# Altium schematic sheet CAN_ADS1015.SchDoc: CAN and ADC expansor
size A3; Organization: ORGANIZATION; Address1: ADDRESS 1; Address2: ADDRESS 2; Address3: ADDRESS 3; Address4: ADDRESS 4; Revision: 0.0; SheetNumber: 8; SheetTotal: 19; ENG_APP_DATE: --/--/--; DSN_APP_DATE: --/--/--; CHK_APP_DATE: --/--/--
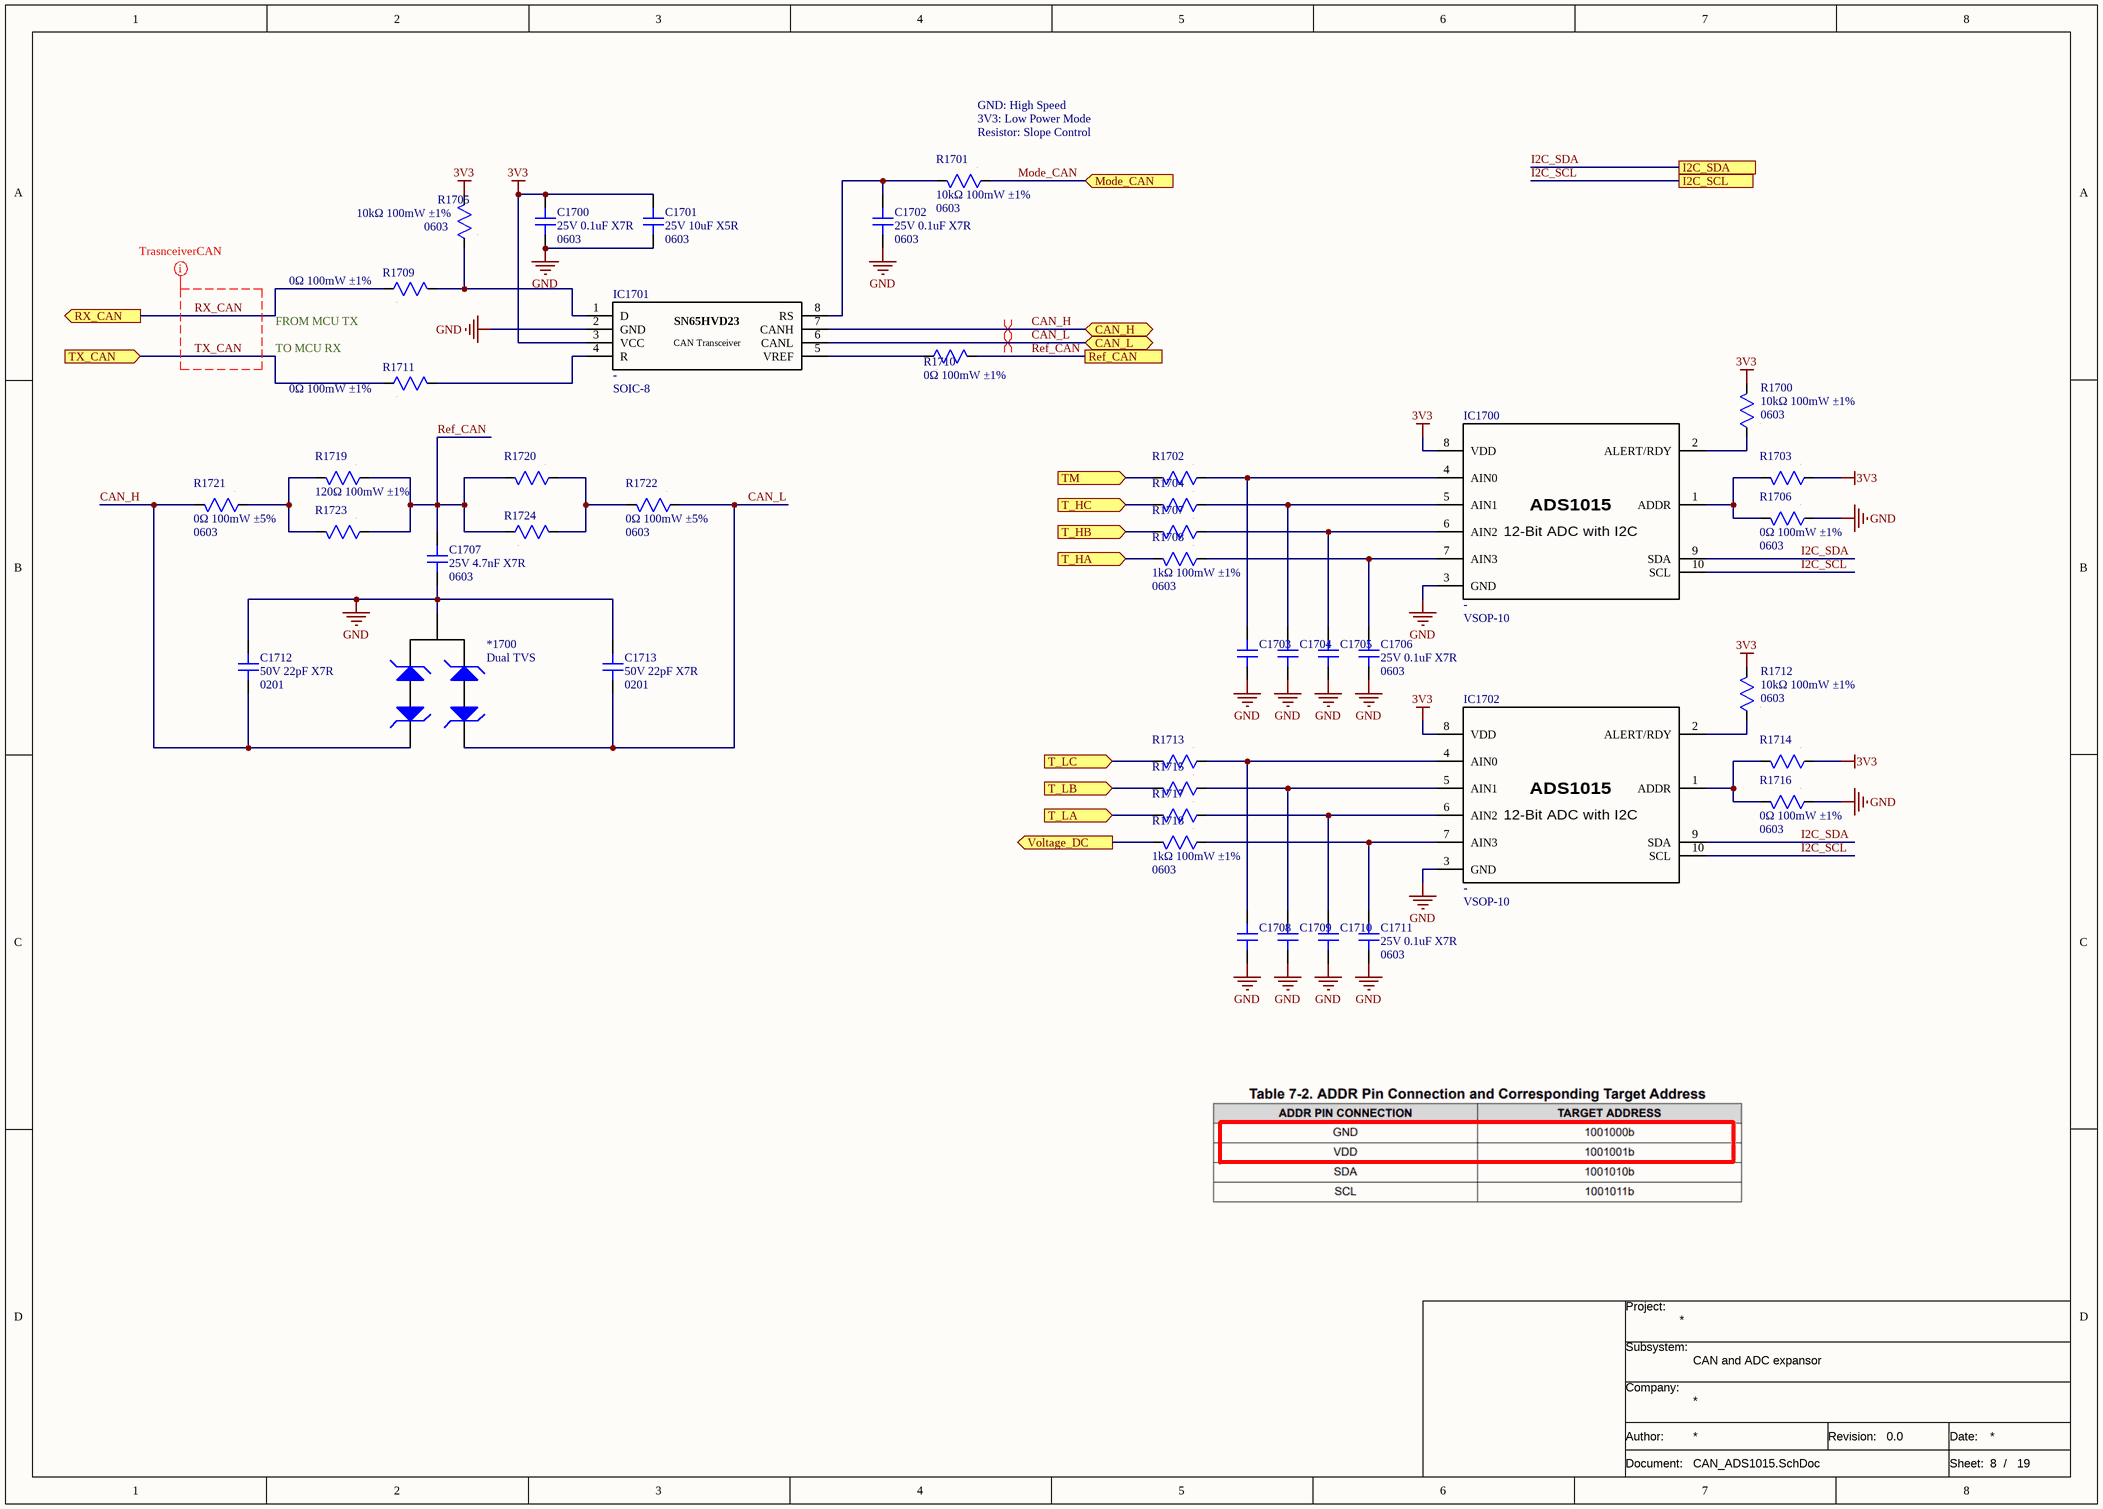
[diagram p0: CAN_ADS1015.SchDoc]

## Parts
*1700  Dual TVS  [SOT-23]
C1700  value 25V 0.1uF X7R  Package: 0603  [CAP SMD 0603]  (hidden comment: CAP non polarized)
C1701  value 25V 10uF X5R  Package: 0603  [CAP SMD 0603]  (hidden comment: CAP non polarized)
C1702  value 25V 0.1uF X7R  Package: 0603  [CAP SMD 0603]  (hidden comment: CAP non polarized)
C1703  CAP non polarized  [CAP SMD 0603]  (value not drawn)
C1704  CAP non polarized  [CAP SMD 0603]  (value not drawn)
C1705  CAP non polarized  [CAP SMD 0603]  (value not drawn)
C1706  value 25V 0.1uF X7R  Package: 0603  [CAP SMD 0603]  (hidden comment: CAP non polarized)
C1707  value 25V 4.7nF X7R  Package: 0603  [CAP SMD 0603]  (hidden comment: CAP non polarized)
C1708  CAP non polarized  [CAP SMD 0603]  (value not drawn)
C1709  CAP non polarized  [CAP SMD 0603]  (value not drawn)
C1710  CAP non polarized  [CAP SMD 0603]  (value not drawn)
C1711  value 25V 0.1uF X7R  Package: 0603  [CAP SMD 0603]  (hidden comment: CAP non polarized)
C1712  value 50V 22pF X7R  Package: 0201  [CAP SMD 0201]  (hidden comment: CAP non polarized)
C1713  value 50V 22pF X7R  Package: 0201  [CAP SMD 0201]  (hidden comment: CAP non polarized)
IC1700  ADS1015  [VSOP-10]  (value not drawn)
IC1701  SN65HVD23  [SOIC-8]  (value not drawn)
IC1702  ADS1015  [VSOP-10]  (value not drawn)
R1700  value 10kΩ 100mW ±1%  Package: 0603  [RES SMD 0603]  (hidden comment: RES)
R1701  value 10kΩ 100mW ±1%  Package: 0603  [RES SMD 0603]  (hidden comment: RES)
R1702  RES  [RES SMD 0603]  (value not drawn)
R1703  RES  [RES SMD 0603]  (value not drawn)
R1704  RES  [RES SMD 0603]  (value not drawn)
R1705  value 10kΩ 100mW ±1%  Package: 0603  [RES SMD 0603]  (hidden comment: RES)
R1706  value 0Ω 100mW ±1%  Package: 0603  [RES SMD 0603]  (hidden comment: RES)
R1707  RES  [RES SMD 0603]  (value not drawn)
R1708  value 1kΩ 100mW ±1%  Package: 0603  [RES SMD 0603]  (hidden comment: RES)
R1709  value 0Ω 100mW ±1%  [RES SMD 0603]  (hidden comment: RES)
R1710  value 0Ω 100mW ±1%  [RES SMD 0603]  (hidden comment: RES)
R1711  value 0Ω 100mW ±1%  [RES SMD 0603]  (hidden comment: RES)
R1712  value 10kΩ 100mW ±1%  Package: 0603  [RES SMD 0603]  (hidden comment: RES)
R1713  RES  [RES SMD 0603]  (value not drawn)
R1714  RES  [RES SMD 0603]  (value not drawn)
R1715  RES  [RES SMD 0603]  (value not drawn)
R1716  value 0Ω 100mW ±1%  Package: 0603  [RES SMD 0603]  (hidden comment: RES)
R1717  RES  [RES SMD 0603]  (value not drawn)
R1718  value 1kΩ 100mW ±1%  Package: 0603  [RES SMD 0603]  (hidden comment: RES)
R1719  value 120Ω 100mW ±1%  [RES SMD 0603]  (hidden comment: RES)
R1720  RES  [RES SMD 0603]  (value not drawn)
R1721  value 0Ω 100mW ±5%  Package: 0603  [RES SMD 0603]  (hidden comment: RES)
R1722  value 0Ω 100mW ±5%  Package: 0603  [RES SMD 0603]  (hidden comment: RES)
R1723  RES  [RES SMD 0603]  (value not drawn)
R1724  RES  [RES SMD 0603]  (value not drawn)

## Ports
CAN_H (bidir), CAN_L (bidir), I2C_SCL, I2C_SDA, Mode_CAN (in), Ref_CAN, RX_CAN (out), T_HA (in), T_HB (in), T_HC (in), T_LA (in), T_LB (in), T_LC (in), TM (in), TX_CAN (in), Voltage_DC (out)

## Nets
3V3: C1700.1 C1701.1 IC1700.8(VDD) IC1701.3(VCC) IC1702.8(VDD) R1700.2 R1703.1 R1705.2 R1712.2 R1714.1
GND: *1700.3 C1700.2 C1701.2 C1702.2 C1703.2 C1704.2 C1705.2 C1706.2 C1707.2 C1708.2 C1709.2 C1710.2 C1711.2 C1712.1 C1713.1 IC1700.3(GND) IC1701.2(GND) IC1702.3(GND) R1706.1 R1716.1
CAN_H: *1700.1 C1712.2 IC1701.7(CANH) R1721.2 ; port CAN_H
CAN_L: *1700.2 C1713.2 IC1701.6(CANL) R1722.1 ; port CAN_L
I2C_SCL: IC1700.10(SCL) IC1702.10(SCL) ; port I2C_SCL
I2C_SDA: IC1700.9(SDA) IC1702.9(SDA) ; port I2C_SDA
Mode_CAN: R1701.1 ; port Mode_CAN
Ref_CAN: C1707.1 R1710.2 R1719.1 R1720.2 R1723.1 R1724.1 ; port Ref_CAN
RX_CAN: R1709.1 ; port RX_CAN
T_HA: R1708.2 ; port T_HA
T_HB: R1707.2 ; port T_HB
T_HC: R1704.2 ; port T_HC
T_LA: R1717.2 ; port T_LA
T_LB: R1715.2 ; port T_LB
T_LC: R1713.2 ; port T_LC
TM: R1702.2 ; port TM
TX_CAN: R1711.1 ; port TX_CAN
Voltage_DC: R1718.2 ; port Voltage_DC
NetC1702_1: C1702.1 IC1701.8(RS) R1701.2
NetC1703_1: C1703.1 IC1700.4(AIN0) R1702.1
NetC1704_1: C1704.1 IC1700.5(AIN1) R1704.1
NetC1705_1: C1705.1 IC1700.6(AIN2) R1707.1
NetC1706_1: C1706.1 IC1700.7(AIN3) R1708.1
NetC1708_1: C1708.1 IC1702.4(AIN0) R1713.1
NetC1709_1: C1709.1 IC1702.5(AIN1) R1715.1
NetC1710_1: C1710.1 IC1702.6(AIN2) R1717.1
NetC1711_1: C1711.1 IC1702.7(AIN3) R1718.1
NetIC1700_1: IC1700.1(ADDR) R1703.2 R1706.2
NetIC1700_2: IC1700.2(ALERT/RDY) R1700.1
NetIC1701_1: IC1701.1(D) R1705.1 R1709.2
NetIC1701_4: IC1701.4(R) R1711.2
NetIC1701_5: IC1701.5(VREF) R1710.1
NetIC1702_1: IC1702.1(ADDR) R1714.2 R1716.2
NetIC1702_2: IC1702.2(ALERT/RDY) R1712.1
NetR1719_2: R1719.2 R1721.1 R1723.2
NetR1720_1: R1720.1 R1722.2 R1724.2

## Layout directives
net class TrasnceiverCAN: RX_CAN, TX_CAN
differential pair: CAN_H, CAN_L

## Notes on the sheet
- GND: High Speed
- 3V3: Low Power Mode
- (near R1701) Resistor: Slope Control
- FROM MCU TX
- TO MCU RX
- Project:
- Subsystem:
- Company:
- Document:
- Author:
- Revision:
- Date:
- Sheet:
- /
- (in symbol 050-0007) CAN Transceiver
- (in symbol 050-0008) 12-Bit ADC with I2C

## Library data of the parts
*1700 = 032-0023: Diodos de Protección contra ESD / Diodos TVS Automotive dual 3- p F +/-24-V +/-30-k; MPN: ESD2CAN24DBZRQ1; Manufacturer: Texas Instruments; ComponentLink1Description: Datasheet; ComponentLink1URL: https://www.ti.com/lit/ds/symlink/esd2canxl24-q1.pdf?ts=1782719399037&ref_url=https%253A%252F%252Fwww.mouser.it%252F; ComponentLink2Description: Distributor Link; ComponentLink2URL: https://www.mouser.es/ProductDetail/Texas-Instruments/ESD2CAN24DBZRQ1?qs=Y0Uzf4wQF3knJz9mU6BNuw%3D%3D; ID: 032-0023; Value: -; Package: SOT-23-3; Distributor PN: 595-ESD2CAN24DBZRQ1; Distributor: Mouser
C1700 C1702 C1706 C1711 = 001-0115: Condensadores de cerámica multicapa (MLCC- SMD/SMT) WCAP-CSGP 0.1uF 0603 10% 25V MLCC; MPN: 885012206071; Manufacturer: Wurth Elektronik; ComponentLink1Description: Datasheet; ComponentLink1URL: https://www.we-online.com/components/products/datasheet/885012206071.pdf; ComponentLink2Description: Distributor Link; ComponentLink2URL: https://www.mouser.es/ProductDetail/Wurth-Elektronik/885012206071?qs=0KOYDY2FL2%2FEBQkuHgvarg%3D%3D; ID: 001-0115; Distributor PN: 710-885012206071; Distributor: Mouser
C1701 = 001-0114: Condensadores de cerámica multicapa (MLCC- SMD/SMT) 0603 25VDC 10uF 10% X5R; MPN: ZRB18AR61E106KE01L; Manufacturer: muRata; ComponentLink1Description: Datasheet; ComponentLink1URL: https://www.mouser.es/ProductDetail/Murata-Electronics/ZRB18AR61E106KE01L?qs=sGAEpiMZZMsh%252B1woXyUXj%2Fze%252BJJ8bUKCZuLWV6qOmdQ%3D; ComponentLink2Description: Distributor Link; ComponentLink2URL: https://www.mouser.es/datasheet/3/76/2/ZRB18AR61E106KE01_02A.pdf; ID: 001-0114; Distributor PN: 81-ZRB18AR61E106KE1L; Distributor: Mouser
C1703-C1705 C1708-C1710 = 001-0115: Condensadores de cerámica multicapa (MLCC- SMD/SMT) WCAP-CSGP 0.1uF 0603 10% 25V MLCC; MPN: 885012206071; Manufacturer: Wurth Elektronik; Value: 25V 0.1uF X7R; ComponentLink1Description: Datasheet; ComponentLink1URL: https://www.we-online.com/components/products/datasheet/885012206071.pdf; ComponentLink2Description: Distributor Link; ComponentLink2URL: https://www.mouser.es/ProductDetail/Wurth-Elektronik/885012206071?qs=0KOYDY2FL2%2FEBQkuHgvarg%3D%3D; Package: 0603; ID: 001-0115; Distributor PN: 710-885012206071; Distributor: Mouser
C1707 = 001-0125: Condensadores de cerámica multicapa (MLCC- SMD/SMT) WCAP-CSGP 4700pF 0603 10% 25V MLCC; MPN: 885012206063; Manufacturer: Wurth Elektronik; ComponentLink1Description: Datasheet; ComponentLink1URL: https://www.we-online.com/components/products/datasheet/885012206063.pdf; ComponentLink2Description: Distributor Link; ComponentLink2URL: https://www.mouser.es/ProductDetail/Wurth-Elektronik/885012206063?qs=0KOYDY2FL285eK3hQulgUw%3D%3D; ID: 001-0125; Distributor PN: 710-885012206063; Distributor: Mouser
C1712 C1713 = 001-0126: Condensadores de cerámica multicapa (MLCC- SMD/SMT) WCAP-CSGP 50VDC 22pF 0201 5%; MPN: 885012004012; Manufacturer: Wurth Elektronik; ComponentLink1Description: Datasheet; ComponentLink1URL: https://www.we-online.com/components/products/datasheet/885012004012.pdf; ComponentLink2Description: Distributor Link; ComponentLink2URL: https://www.mouser.es/ProductDetail/Wurth-Elektronik/885012004012?qs=rQFj71Wb1eXV%2FFwrY5Shkg%3D%3D; ID: 001-0126; Distributor PN: 710-885012004012; Distributor: Mouser
IC1700 IC1702 = 050-0008: Conversores de analógico a digital (ADC) 12-Bit ADC I2C-Comp atible 3.3kSPS Wit A A 595-ADS1015IDGST; MPN: ADS1015IDGSR; Manufacturer: Texas Instruments; ComponentLink1Description: Datasheet; ComponentLink1URL: https://www.ti.com/lit/ds/symlink/ads1013.pdf?ts=1782833806674&ref_url=https%253A%252F%252Fwww.mouser.com%252F; ComponentLink2Description: Distributor Link; ComponentLink2URL: https://www.mouser.es/ProductDetail/Texas-Instruments/ADS1015IDGSR?qs=IK5e5L0zOXhCrFZ0pftZqw%3D%3D; ID: 050-0008; Value: -; Package: VSOP-10; Distributor PN: 595-ADS1015IDGSR; Distributor: Mouser
IC1701 = 050-0007: Sensores de corriente montados en placa; MPN: SN65HVD230DR; Manufacturer: Texas Instruments; ComponentLink1Description: Datasheet; ComponentLink1URL: https://www.ti.com/lit/ds/symlink/sn65hvd232.pdf?ts=1782719100047&ref_url=https%253A%252F%252Fwww.mouser.tw%252F; ComponentLink2Description: Distributor Link; ComponentLink2URL: https://www.mouser.es/ProductDetail/Texas-Instruments/SN65HVD230DR?qs=QViXGNcIEAtifeQR3pYVUQ%3D%3D; ID: 050-0007; Value: -; Package: SOIC-8; Distributor PN: 595-SN65HVD230DR; Distributor: Mouser
R1700 R1701 R1705 R1712 = 010-0145: Resistores de película gruesa - SMD WRIS-RSKS 10 kOhms 1 % 0.1 W 0603 AEC-Q200; MPN: 560112116005; Manufacturer: Wurth Elektronik; ComponentLink1Description: Datasheet; ComponentLink1URL: https://www.we-online.com/components/products/datasheet/560112116005.pdf; ComponentLink2Description: Distributor Link; ComponentLink2URL: https://www.mouser.es/ProductDetail/Wurth-Elektronik/560112116005?qs=mELouGlnn3dMVSPHwBGouA%3D%3D; ID: 010-0145; Distributor PN: 710-560112116005; Distributor: Mouser
R1702 R1704 R1707 R1713 R1715 R1717 = 010-0170: Thick Film Resistors WRIS-RSKS 1 kOhms 1 % 0.1 W 0603 AEC-Q200; MPN: 560112116014; Manufacturer: Wurth Elektronik; Value: 1kΩ 100mW ±1%; ComponentLink1Description: Datasheet; ComponentLink1URL: https://www.we-online.com/components/products/datasheet/560112116014.pdf; ComponentLink2Description: Distributor Link; ComponentLink2URL: https://www.mouser.es/ProductDetail/Wurth-Elektronik/560112116014?qs=sGAEpiMZZMvdGkrng054txLI%2FDB4oIKD92viHLDiYpSVemZawWv4yQ%3D%3D; Package: 0603; ID: 010-0170; Distributor PN: 710-560112116014; Distributor: Mouser
R1703 R1714 = 010-0160: Resistores de película gruesa - SMD WRIS-RSKS <0.05 Ohms 0.1 W Jumper 0603 AEC-Q200; MPN: 560112116001; Manufacturer: Wurth Elektronik; Value: 0Ω 100mW ±1%; ComponentLink1Description: Datasheet; ComponentLink1URL: https://www.we-online.com/components/products/datasheet/560112116001.pdf; ComponentLink2Description: Distributor Link; ComponentLink2URL: https://www.mouser.es/ProductDetail/Wurth-Elektronik/560112116001?qs=mELouGlnn3dlnHYj7TecuA%3D%3D; Package: 0603; ID: 010-0160; Distributor PN: 710-560112116001; Distributor: Mouser
R1706 R1709-R1711 R1716 = 010-0160: Resistores de película gruesa - SMD WRIS-RSKS <0.05 Ohms 0.1 W Jumper 0603 AEC-Q200; MPN: 560112116001; Manufacturer: Wurth Elektronik; ComponentLink1Description: Datasheet; ComponentLink1URL: https://www.we-online.com/components/products/datasheet/560112116001.pdf; ComponentLink2Description: Distributor Link; ComponentLink2URL: https://www.mouser.es/ProductDetail/Wurth-Elektronik/560112116001?qs=mELouGlnn3dlnHYj7TecuA%3D%3D; ID: 010-0160; Distributor PN: 710-560112116001; Distributor: Mouser
  R1709-R1711: Package: 0603
R1708 R1718 = 010-0170: Thick Film Resistors WRIS-RSKS 1 kOhms 1 % 0.1 W 0603 AEC-Q200; MPN: 560112116014; Manufacturer: Wurth Elektronik; ComponentLink1Description: Datasheet; ComponentLink1URL: https://www.we-online.com/components/products/datasheet/560112116014.pdf; ComponentLink2Description: Distributor Link; ComponentLink2URL: https://www.mouser.es/ProductDetail/Wurth-Elektronik/560112116014?qs=sGAEpiMZZMvdGkrng054txLI%2FDB4oIKD92viHLDiYpSVemZawWv4yQ%3D%3D; ID: 010-0170; Distributor PN: 710-560112116014; Distributor: Mouser
R1719 R1720 R1724 = 010-0177: Resistores de película gruesa - SMD WRIS-RSKS 120 Ohms 1 % 0.1 W 0603 AEC-Q200; MPN: 560112116119; Manufacturer: Wurth Elektronik; ComponentLink1Description: Datasheet; ComponentLink1URL: https://www.we-online.com/components/products/datasheet/560112116119.pdf; ComponentLink2Description: Distributor Link; ComponentLink2URL: https://www.mouser.es/ProductDetail/Wurth-Elektronik/560112116119?qs=mELouGlnn3eT%2F22oIMY8Ng%3D%3D; ID: 010-0177; Distributor PN: 710-560112116119; Distributor: Mouser
  R1719: Package: 0603
R1721 R1722 = 010-0142: Resistores de película gruesa - SMD WRIS-RSKS <0.05 Ohms 0.1 W Jumper 0603 AEC-Q200; MPN: 560112116001; Manufacturer: Wurth Elektronik; ComponentLink1Description: Datasheet; ComponentLink1URL: https://www.we-online.com/components/products/datasheet/560112116001.pdf; ComponentLink2Description: Distributor Link; ComponentLink2URL: https://www.mouser.es/ProductDetail/Wurth-Elektronik/560112116001?qs=mELouGlnn3dlnHYj7TecuA%3D%3D; ID: 010-0142; Distributor PN: 710-560112116001; Distributor: Mouser
R1723 = 010-0177: Resistores de película gruesa - SMD WRIS-RSKS 120 Ohms 1 % 0.1 W 0603 AEC-Q200; MPN: 560112116119; Manufacturer: Wurth Elektronik; Value: 120Ω 100mW ±1%; ComponentLink1Description: Datasheet; ComponentLink1URL: https://www.we-online.com/components/products/datasheet/560112116119.pdf; ComponentLink2Description: Distributor Link; ComponentLink2URL: https://www.mouser.es/ProductDetail/Wurth-Elektronik/560112116119?qs=mELouGlnn3eT%2F22oIMY8Ng%3D%3D; Package: 0603; ID: 010-0177; Distributor PN: 710-560112116119; Distributor: Mouser